# Altium schematic sheet [8] FPGA.SchDoc: FPGA
size 393 x 281 mm; SheetNumber: 8; SheetTotal: 21; PageSetup: Record=PageOptions|CenterHorizontal=True|CenterVertical=True|PrintScale=0.94|XCorrection=0.00|YCorrection=0.00|PrintKind=0|BorderSize=5000000|LeftOffset=0|BottomOffset=0|Orientation=2|PaperLength=1000|PaperWidth=1000|Scale=100|PaperSource=15|PrintQuality=600|MediaType=1|DitherType=10|PrintScaleMode=1|PaperKind=A4; Adr1: August Barks gata 6B; Adr2: SE-421 32 Västra Frölunda; Adr3: Sweden; Webpage: www.omnisys.se
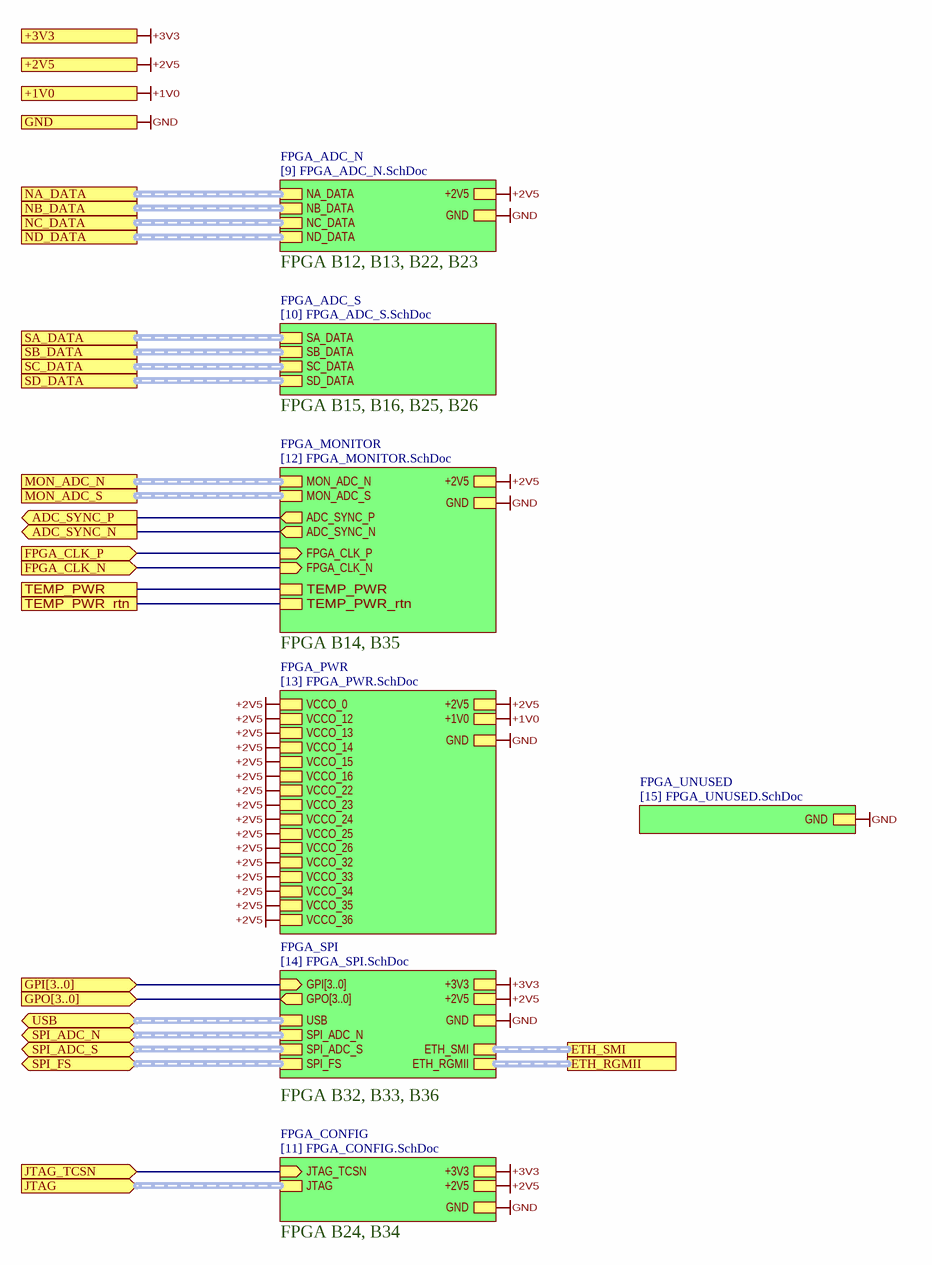
[diagram p0: [8] FPGA.SchDoc]

## Sub-sheets
FPGA_ADC_N = [9] FPGA_ADC_N.SchDoc: NA_DATA (harness ADC Port), NC_DATA (harness ADC Port), ND_DATA (harness ADC Port), NB_DATA (harness ADC Port), GND, +2V5
FPGA_ADC_S = [10] FPGA_ADC_S.SchDoc: SA_DATA (harness ADC Port), SC_DATA (harness ADC Port), SD_DATA (harness ADC Port), SB_DATA (harness ADC Port)
FPGA_CONFIG = [11] FPGA_CONFIG.SchDoc: JTAG_TCSN (in), JTAG (harness USB JTAG), GND, +2V5, +3V3
FPGA_MONITOR = [12] FPGA_MONITOR.SchDoc: MON_ADC_N (harness MON_ADC), MON_ADC_S (harness MON_ADC), FPGA_CLK_P (in), FPGA_CLK_N (in), ADC_SYNC_P (out), ADC_SYNC_N (out), +2V5, GND, TEMP_PWR_rtn, TEMP_PWR
FPGA_PWR = [13] FPGA_PWR.SchDoc: VCCO_36, +2V5, VCCO_12, VCCO_13, VCCO_14, VCCO_15, VCCO_16, VCCO_22, VCCO_23, VCCO_24, VCCO_25, VCCO_26, VCCO_32, VCCO_33, VCCO_34, VCCO_35, +1V0, GND, VCCO_0
FPGA_SPI = [14] FPGA_SPI.SchDoc: USB (harness USB FIFO), SPI_ADC_N (harness SPI_ADC), SPI_ADC_S (harness SPI_ADC), SPI_FS (harness SPI_FS), GPI[3..0] (in), +3V3, GND, +2V5, ETH_SMI (harness ETH_SMI), ETH_RGMII (harness ETH_RGMII), GPO[3..0] (out)
FPGA_UNUSED = [15] FPGA_UNUSED.SchDoc: GND

## Ports
+1V0, +2V5, +3V3, ADC_SYNC_N (out), ADC_SYNC_P (out), ETH_RGMII (harness ETH_RGMII), ETH_SMI (harness ETH_SMI), FPGA_CLK_N (in), FPGA_CLK_P (in), GND, GPI[3..0] (in), GPO[3..0] (in), JTAG (in, harness USB JTAG), JTAG_TCSN (in), MON_ADC_N (harness MON_ADC), MON_ADC_S (harness MON_ADC), NA_DATA (harness ADC Port), NB_DATA (harness ADC Port), NC_DATA (harness ADC Port), ND_DATA (harness ADC Port), SA_DATA (harness ADC Port), SB_DATA (harness ADC Port), SC_DATA (harness ADC Port), SD_DATA (harness ADC Port), SPI_ADC_N (bidir, harness SPI_ADC), SPI_ADC_S (bidir, harness SPI_ADC), SPI_FS (bidir, harness SPI_FS), TEMP_PWR, TEMP_PWR_rtn, USB (bidir, harness USB FIFO)

## Nets
+1V0: port +1V0, sheet FPGA_PWR/+1V0
+2V5: port +2V5, sheet FPGA_PWR/VCCO_36, sheet FPGA_PWR/+2V5, sheet FPGA_PWR/VCCO_12, sheet FPGA_PWR/VCCO_13, sheet FPGA_PWR/VCCO_14, sheet FPGA_PWR/VCCO_15, sheet FPGA_PWR/VCCO_16, sheet FPGA_PWR/VCCO_22, sheet FPGA_PWR/VCCO_23, sheet FPGA_PWR/VCCO_24, sheet FPGA_PWR/VCCO_25, sheet FPGA_PWR/VCCO_26, sheet FPGA_PWR/VCCO_32, sheet FPGA_PWR/VCCO_33, sheet FPGA_PWR/VCCO_34, sheet FPGA_PWR/VCCO_35, sheet FPGA_PWR/VCCO_0, sheet FPGA_ADC_N/+2V5, sheet FPGA_SPI/+2V5, sheet FPGA_MONITOR/+2V5, sheet FPGA_CONFIG/+2V5
+3V3: port +3V3, sheet FPGA_SPI/+3V3, sheet FPGA_CONFIG/+3V3
GND: port GND, sheet FPGA_PWR/GND, sheet FPGA_ADC_N/GND, sheet FPGA_SPI/GND, sheet FPGA_MONITOR/GND, sheet FPGA_UNUSED/GND, sheet FPGA_CONFIG/GND
ADC_SYNC_N: port ADC_SYNC_N, sheet FPGA_MONITOR/ADC_SYNC_N
ADC_SYNC_P: port ADC_SYNC_P, sheet FPGA_MONITOR/ADC_SYNC_P
FPGA_CLK_N: port FPGA_CLK_N, sheet FPGA_MONITOR/FPGA_CLK_N
FPGA_CLK_P: port FPGA_CLK_P, sheet FPGA_MONITOR/FPGA_CLK_P
JTAG_TCSN: port JTAG_TCSN, sheet FPGA_CONFIG/JTAG_TCSN
TEMP_PWR: port TEMP_PWR, sheet FPGA_MONITOR/TEMP_PWR
TEMP_PWR_rtn: port TEMP_PWR_rtn, sheet FPGA_MONITOR/TEMP_PWR_rtn

## Buses and harness runs
bus port GPI[3..0] = sheet FPGA_SPI/GPI[3..0]
bus port GPO[3..0] = sheet FPGA_SPI/GPO[3..0]
harness port ETH_RGMII = sheet FPGA_SPI/ETH_RGMII
harness port ETH_SMI = sheet FPGA_SPI/ETH_SMI
harness port JTAG = sheet FPGA_CONFIG/JTAG
harness port MON_ADC_N = sheet FPGA_MONITOR/MON_ADC_N
harness port MON_ADC_S = sheet FPGA_MONITOR/MON_ADC_S
harness port NA_DATA = sheet FPGA_ADC_N/NA_DATA
harness port NB_DATA = sheet FPGA_ADC_N/NB_DATA
harness port NC_DATA = sheet FPGA_ADC_N/NC_DATA
harness port ND_DATA = sheet FPGA_ADC_N/ND_DATA
harness port SA_DATA = sheet FPGA_ADC_S/SA_DATA
harness port SB_DATA = sheet FPGA_ADC_S/SB_DATA
harness port SC_DATA = sheet FPGA_ADC_S/SC_DATA
harness port SD_DATA = sheet FPGA_ADC_S/SD_DATA
harness port SPI_ADC_N = sheet FPGA_SPI/SPI_ADC_N
harness port SPI_ADC_S = sheet FPGA_SPI/SPI_ADC_S
harness port SPI_FS = sheet FPGA_SPI/SPI_FS
harness port USB = sheet FPGA_SPI/USB

## Notes on the sheet
- FPGA B12, B13, B22, B23
- FPGA B15, B16, B25, B26
- FPGA B14, B35
- FPGA B32, B33, B36
- FPGA B24, B34
- Title:
- SVN:
- August Barks gata 6B
- SE-421 32 Västra Frölunda
- Omnisys Instruments AB
- PCB ASY:
- PCB:
- SVN Folder:
- www.omnisys.se
- Page:
- of
- Print date:
- Page size:
- A3
- Information contained in this drawing is confidential. Copying, distributing or use in any matter, other than that specified by OMNISYS INSTRUMENTS AB, is strictly prohibited.